# Altium schematic sheet VCO_BFP420.SchDoc: Voltage Controlled Oscillator
size A4; Author: Alemla; Revision: 1.2; SheetNumber: 3; SheetTotal: 7; SPICEModelCacheUMHTQHEF: <root> / <DocumentId>UMHTQHEF</DocumentId> / </root>
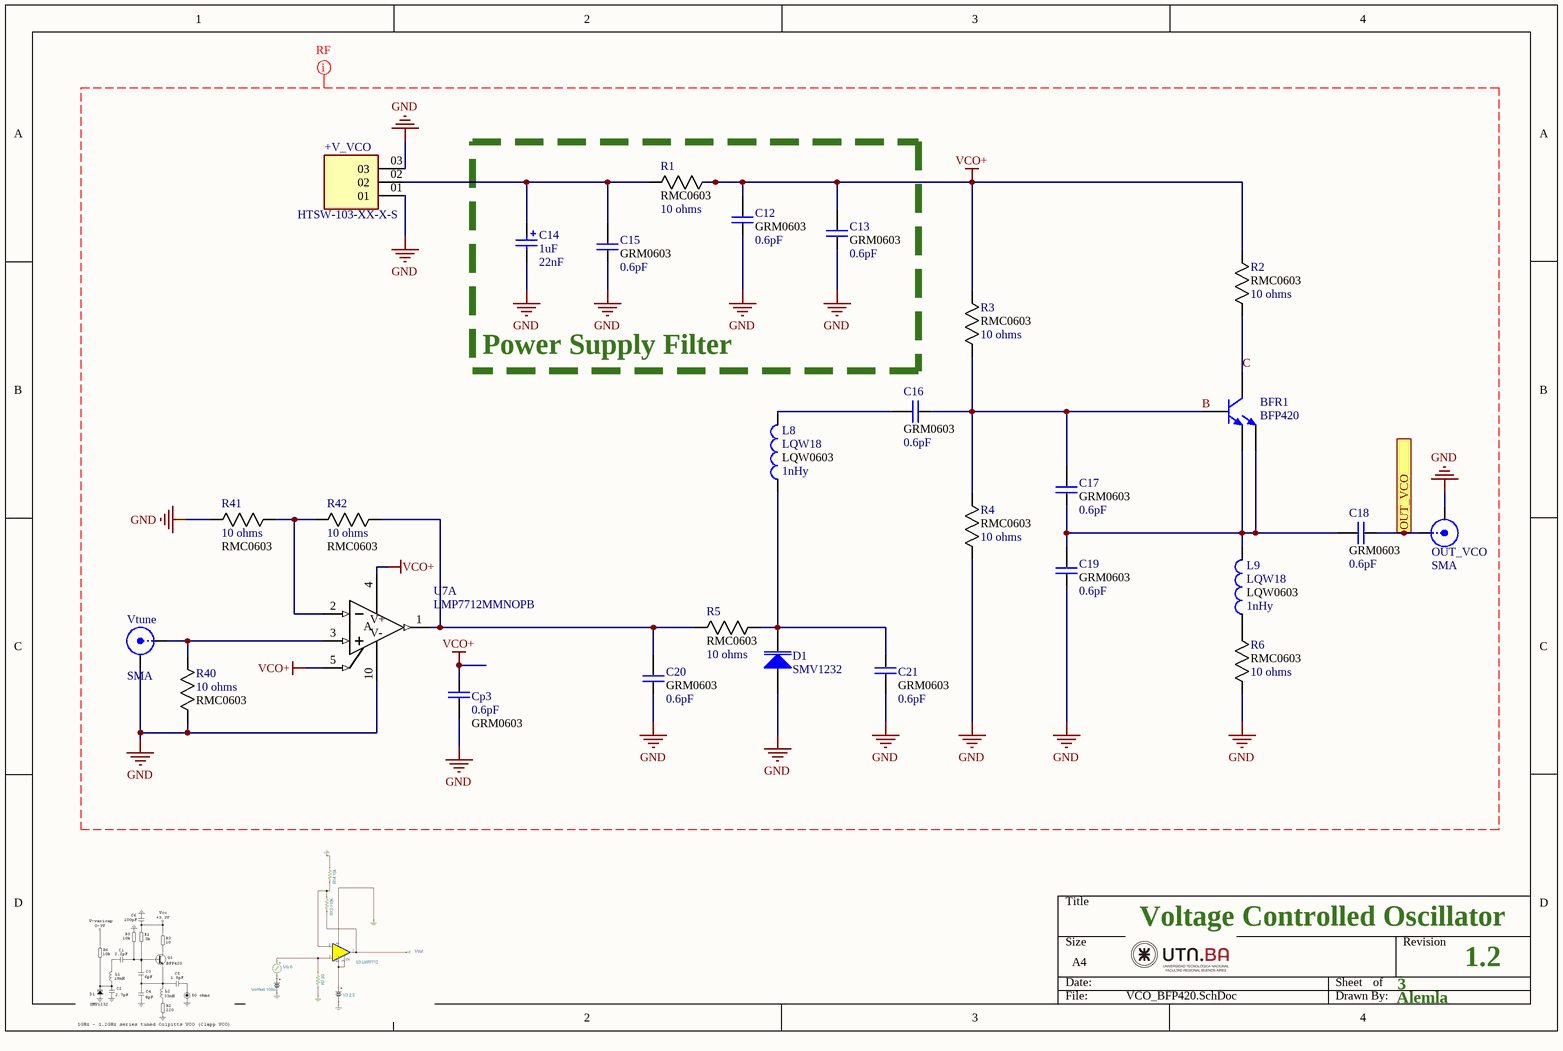
[diagram p0: VCO_BFP420.SchDoc]

## Parts
+V_VCO  HTSW-103-XX-X-S  [SAMTEC_HTSW-103-XX-X-S]
BFR1  BFP420  [SOT-343_N]
C12  value 0.6pF  footprint: GRM0603  [CAPC1608X90N]  (hidden comment: Cap 0603)
C13  value 0.6pF  footprint: GRM0603  [CAPC1608X90N]  (hidden comment: Cap 0603)
C14  1uF  value 22nF  [6-0805_N]
C15  value 0.6pF  footprint: GRM0603  [CAPC1608X90N]  (hidden comment: Cap 0603)
C16  value 0.6pF  footprint: GRM0603  [CAPC1608X90N]  (hidden comment: Cap 0603)
C17  value 0.6pF  footprint: GRM0603  [CAPC1608X90N]  (hidden comment: Cap 0603)
C18  value 0.6pF  footprint: GRM0603  [CAPC1608X90N]  (hidden comment: Cap 0603)
C19  value 0.6pF  footprint: GRM0603  [CAPC1608X90N]  (hidden comment: Cap 0603)
C20  value 0.6pF  footprint: GRM0603  [CAPC1608X90N]  (hidden comment: Cap 0603)
C21  value 0.6pF  footprint: GRM0603  [CAPC1608X90N]  (hidden comment: Cap 0603)
Cp3  value 0.6pF  footprint: GRM0603  [CAPC1608X90N]  (hidden comment: Cap 0603)
D1  SMV1232  [6-0805_N]
L8  LQW18  value 1nHy  Parameter 1: LQW0603  [INDC1608X100N]
L9  LQW18  value 1nHy  Parameter 1: LQW0603  [INDC1608X100N]
OUT_VCO  SMA  [SMA-142-0701-851_V2]
R1  value 10 ohms  footprint: RMC0603  [RESC1508X55N]  (hidden comment: Resistor)
R2  value 10 ohms  footprint: RMC0603  [RESC1508X55N]  (hidden comment: Resistor)
R3  value 10 ohms  footprint: RMC0603  [RESC1508X55N]  (hidden comment: Resistor)
R4  value 10 ohms  footprint: RMC0603  [RESC1508X55N]  (hidden comment: Resistor)
R5  value 10 ohms  footprint: RMC0603  [RESC1508X55N]  (hidden comment: Resistor)
R6  value 10 ohms  footprint: RMC0603  [RESC1508X55N]  (hidden comment: Resistor)
R40  value 10 ohms  footprint: RMC0603  [RESC1508X55N]  (hidden comment: Resistor)
R41  value 10 ohms  footprint: RMC0603  [RESC1508X55N]  (hidden comment: Resistor)
R42  value 10 ohms  footprint: RMC0603  [RESC1508X55N]  (hidden comment: Resistor)
U7  LMP7712MMNOPB  [SOP50P490X110-10N]  (part A of 2)
Vtune  SMA  [SMA-142-0701-851_V2]

## Ports
OUT_VCO (out)

## Nets
GND: +V_VCO.01 +V_VCO.03 C12.1 C13.1 C14.2 C15.1 C19.1 C20.1 C21.2 Cp3.2 D1.1(A) OUT_VCO.2(Y) R4.1 R6.1 R40.1 R41.1 U7.10(V+) Vtune.2(Y)
VCO+: C12.2 C13.2 Cp3.1 R1.2 R2.2 R3.2 U7.4(V-) U7.5(SD1)
B: BFR1.4(B) C16.1 C17.2 R3.1 R4.2
C: BFR1.2(C) R2.1
OUT_VCO: C18.1 OUT_VCO.1(X) ; port OUT_VCO
Net+V_VCO_02: +V_VCO.02 C14.1 C15.2 R1.1
NetBFR1_1: BFR1.1(E) BFR1.3(E) C17.1 C18.2 C19.2 L9.2
NetC16_2: C16.2 L8.2
NetC20_2: C20.2 R5.2 R42.2 U7.1(OUT)
NetC21_1: C21.1 D1.2(K) L8.1 R5.1
NetL9_1: L9.1 R6.2
NetR40_2: R40.2 U7.3(IN+) Vtune.1(X)
NetR41_2: R41.2 R42.1 U7.2(IN-)

## Layout directives
net class RF50R: B, C, GND, VCO+

## Notes on the sheet
- Power Supply Filter
- (in symbol LMP7712MMNOPB, part A) A

## Library data of the parts
+V_VCO = HTSW-103-XX-X-S: Conn Unshrouded Header HDR 3 POS 2.54mm Solder ST Top Entry Thru-Hole Bag; MP: HTSW-103-08-S-S; MF: Samtec; SnapEDA_Link: https://www.snapeda.com/parts/HTSW-103-08-S-S/Samtec/view-part/?ref=snap; Purchase-URL: https://pricing.snapeda.com/search/part/HTSW-103-08-S-S/?ref=eda; Value: *; Availability: In Stock; Check_prices: https://www.snapeda.com/parts/HTSW-103-08-S-S/Samtec/view-part/?ref=eda; Package: None; Price: None
BFR1 = BFR460: NPN Bipolar Transistor; Published: 8-Jun-2000; LatestRevisionDate: 17-Jul-2002; LatestRevisionNote: Re-released for DXP Platform.; PackageReference: TO-226-AA; Publisher: Altium Limited; PackageDescription: TO, Flat Index; 3 In-Line, Axial Leads; Body Dia. 4.8mm; Leads 0.55 x 0.51 mm (max); Code_JEDEC: TO-226-AA
C12 C13 C15-C21 Cp3 = Cap: Capacitor GRM18 0603; Published: 8-Jun-2000; LatestRevisionDate: 17-Jul-2002; LatestRevisionNote: Re-released for DXP Platform.; PackageReference: POLAR0.8; Publisher: Altium Limited; PackageDescription: Polarized Capacitor; 2 Leads; Supplier 1: Mouser
C14 = Cap Pol2_1: Polarized Capacitor (Axial); Published: 8-Jun-2000; LatestRevisionDate: 17-Jul-2002; LatestRevisionNote: Re-released for DXP Platform.; PackageReference: POLAR0.8; Publisher: Altium Limited; PackageDescription: Polarized Capacitor; 2 Leads
D1 = D Varactor: Variable Capacitance Diode; Note: Pin 2 is not connected and not drawn.; Published: 8-Jun-2000; LatestRevisionDate: 29-May-2009; LatestRevisionNote: IPC-7351 Footprint Added.; DatasheetVersion: Jan-1998; PackageVersion: 1996; PackageReference: SOT23A; Publisher: Altium Limited; PackageDescription: 3-Pin SOT-23 Package 0.95 mm Pitch, 2.3 mm Lead Span - Reverse Pinning; ComponentLink1Description: Manufacturer Link; ComponentLink1URL: http://www.zetex.com/
L8 L9 = LQW18: Ind RF Chip Wirewound 18nH 5% 100MHz 40Q-Factor 550mA 0603 Paper T/R; MP: LQW18AN18NJ00D; Package: None; Price: None; Availability: Unavailable
OUT_VCO Vtune = SMA: SMA Straight Connector; LatestRevisionDate: 17-Jul-2002; LatestRevisionNote: Re-released for DXP Platform.; Publisher: Altium Limited
R1-R6 R40-R42 = Resistor: Resistor RMC0603; Mfr_Name: Stackpole International
U7 = LMP7712MMNOPB: No Description Available; Mfr_Name: Texas Instruments; Manufacturer: NationalSemiconductor; Characteristics: LMP7712MM18VPrecisonDualLowNoiseCMOSInputOpAmpwithShutdown; CompType: OpAmpIC; TaMin_C: -400; TaMax_C: 1250; ComponentLink1DescBC: LMP7712Datasheet; ComponentLink2DescA4: LMP7712WebPage; ComponentLink3DescAC: MUB10APackageWebPage; SymbolVersion: 2008-07-09; PartNumber: LMP7712MM; PackageDescription: 10LeadMSOP; PackageReference: MUB10A_L; RoHS: O; ComponentLink1URL: http//wwwnationalcom/ds/LM/LMP7712pdf; ComponentLink2URL: http//wwwnationalcom/pf/LM/LMP7712html; ComponentLink3URL: http//wwwnationalcom/packaging/folders/mub10ahtml; Version: B1608; LatestRevisionDate: 2009-03-16; LatestRevisionNote: MassUpdate; Publisher: NationalSemiconductor; Published: 2009-03-16